# Altium project STM32_BLE_Board.PrjPcb
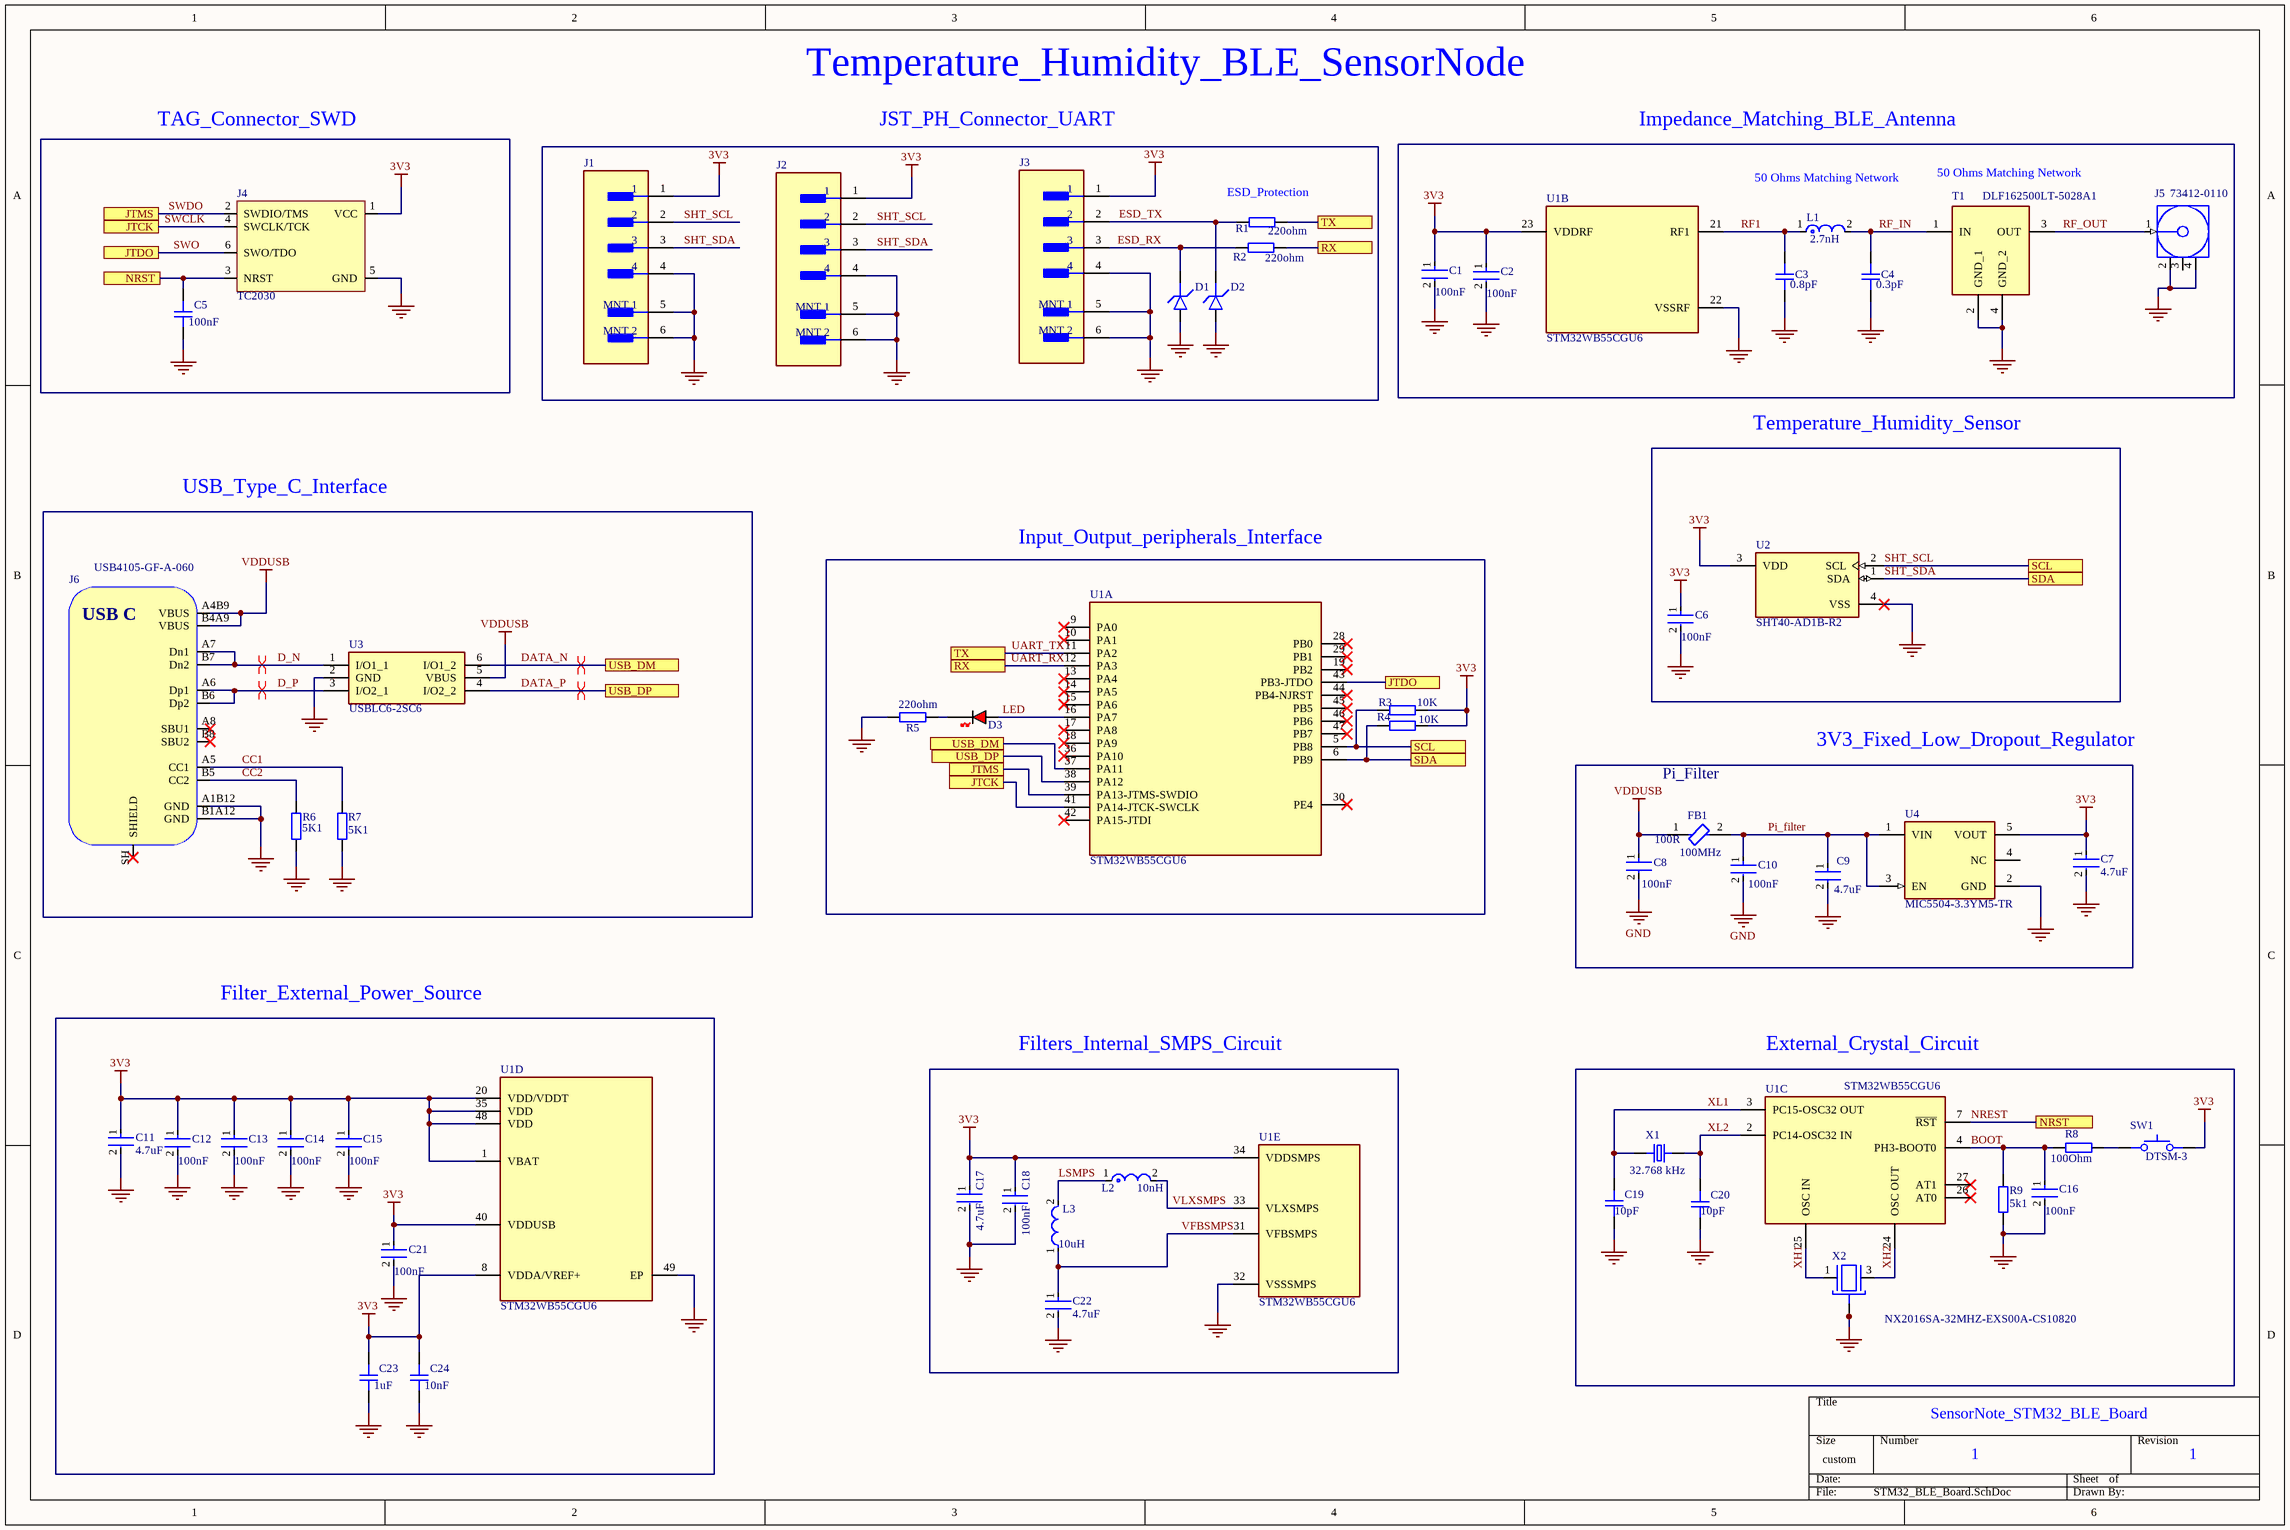
[diagram p0: STM32_BLE_Board.SchDoc]
1 sheet, 54 parts. Net scope: flat (ports and power ports of the same name join across sheets).
Board file: STM32WB55.PcbDoc

## Sheet STM32_BLE_Board.SchDoc
size 449 x 299 mm; SheetNumber: 1; SheetTotal: 1; SPICEModelCacheYUVFMELA: <root> / <DocumentId>YUVFMELA</DocumentId> / </root>

### Parts
C1  Capacitance: 100nF  [FP-C0402-BB-MFG]  (hidden comment: C0402C104K8RAC)
C2  Capacitance: 100nF  [FP-C0402-BB-MFG]  (hidden comment: C0402C104K8RAC)
C3  Rating: 0.8pF  [CAP_0402]  (hidden comment: GRM1555C2AR80BA01D)
C4  Rating: 0.3pF  [CAP_0402]  (hidden comment: GRM1555C1HR30WA01D)
C5  Rating: 100nF  [CAP_0402]  (hidden comment: C0402)
C6  Capacitance: 100nF  [FP-C0402-BB-MFG]  (hidden comment: C0402C104K8RAC)
C7  Capacitance: 4.7uF  [FP-CL10-IPC_C]  (hidden comment: CL10A475KP8NNND)
C8  Capacitance: 100nF  [FP-C0402-BB-MFG]  (hidden comment: C0402C104K8RAC)
C9  Capacitance: 4.7uF  [FP-CL10-IPC_C]  (hidden comment: CL10A475KP8NNND)
C10  Capacitance: 100nF  [FP-C0402-BB-MFG]  (hidden comment: C0402C104K8RAC)
C11  Capacitance: 4.7uF  [FP-CL10-IPC_C]  (hidden comment: CL10A475KP8NNND)
C12  Capacitance: 100nF  [FP-C0402-BB-MFG]  (hidden comment: C0402C104K8RAC)
C13  Capacitance: 100nF  [FP-C0402-BB-MFG]  (hidden comment: C0402C104K8RAC)
C14  Capacitance: 100nF  [FP-C0402-BB-MFG]  (hidden comment: C0402C104K8RAC)
C15  Capacitance: 100nF  [FP-C0402-BB-MFG]  (hidden comment: C0402C104K8RAC)
C16  Capacitance: 100nF  [FP-C0402-BB-MFG]  (hidden comment: C0402C104K8RAC)
C17  Capacitance: 4.7uF  [FP-CL10-IPC_C]  (hidden comment: CL10A475KP8NNND)
C18  Capacitance: 100nF  [FP-C0402-BB-MFG]  (hidden comment: C0402C104K8RAC)
C19  Rating: 10pF  [CAP_0402]  (hidden comment: C0402)
C20  Rating: 10pF  [CAP_0402]  (hidden comment: C0402)
C21  Capacitance: 100nF  [FP-C0402-BB-MFG]  (hidden comment: C0402C104K8RAC)
C22  Capacitance: 4.7uF  [FP-CL10-IPC_C]  (hidden comment: CL10A475KP8NNND)
C23  Rating: 1uF  [CAP_0402]  (hidden comment: C0402)
C24  Rating: 10nF  [CAP_0402]  (hidden comment: C0402)
D1  D_TVS_0402  [D_0402]  (value not drawn)
D2  D_TVS_0402  [D_0402]  (value not drawn)
D3  RED  [LED_0402_RED]  (value not drawn)
FB1  Impedance: 100R  Test Frequency: 100MHz  [FP-BLM18-0_15-t0_5-MFG]  (hidden comment: BLM18EG101TN1D)
J1  S4B-ZR-SM4A-TF(LF)(SN)  [FP-S4B-ZR-SM4A-TF_LF_SN-MFG]  (value not drawn)
J2  S4B-ZR-SM4A-TF(LF)(SN)  [FP-S4B-ZR-SM4A-TF_LF_SN-MFG]  (value not drawn)
J3  S4B-ZR-SM4A-TF(LF)(SN)  [FP-S4B-ZR-SM4A-TF_LF_SN-MFG]  (value not drawn)
J4  TC2030  [TC2030-FP]  (no BOM)
J5  73412-0110  [MOLX-73412-0110_V]
J6  USB4105-GF-A-060  [USB4105-GF-A-060]
L1  Inductance: 2.7nH  [FP-LQG15HH_02-IPC_C]  (hidden comment: LQG15HS2N7S02D)
L2  Inductance: 10nH  [FP-LQG15WH_02-MFG]  (hidden comment: LQG15WZ10NJ02D)
L3  Inductance: 10uH  [FP-LQM21FN_70-MFG]  (hidden comment: LQM21FN100M70L)
R1  220ohm  [RES_0402]
R2  220ohm  [RES_0402]
R3  10K  [RES_0402]
R4  10K  [RES_0402]
R5  220ohm  [RES_0402]
R6  Parameter 1: 5K1  [RES_0402]  (hidden comment: R0402)
R7  5K1  [RES_0402]
R8  Parameter 1: 100Ohm  [RES_0402]  (hidden comment: R0402)
R9  5k1  [RES_0402]
SW1  DTSM-3  [DTSM-3]
T1  DLF162500LT-5028A1  [DLF162500LT5028A1]
U1  STM32WB55CGU6  [FP-STM32WB55CGU6-IPC_B]  (parts A,B,C,D,E of 5)
U2  SHT40-AD1B-R2  [FP-SHT40-AD1B-R2-MFG]
U3  USBLC6-2SC6  [SOT95P280X145-6N]
U4  MIC5504-3.3YM5-TR  [FP-SOT23-5LD-PL-1-MFG]
X1  value 32.768 kHz  [XTAL_NX2012SA-32.768K-STD-MUB-1]  (hidden comment: NX2012SA-32.768K-STD-MUB-1)
X2  NX2016SA-32MHZ-EXS00A-CS10820  [OSC_NX2016SA-24MHZ-EXS00A-CS10820]

### Ports
JTCK (see STM32_BLE_Board[1A]), JTCK (see STM32_BLE_Board[3C]), JTDO (see STM32_BLE_Board[1A]), JTDO (see STM32_BLE_Board[4B]), JTMS (see STM32_BLE_Board[1A]), JTMS (see STM32_BLE_Board[3C]), NRST (see STM32_BLE_Board[1A]), NRST (see STM32_BLE_Board[6C]), RX (see STM32_BLE_Board[3B]), RX (see STM32_BLE_Board[4A]), SCL (see STM32_BLE_Board[4B]), SCL (see STM32_BLE_Board[6B]), SDA (see STM32_BLE_Board[4B]), SDA (see STM32_BLE_Board[6B]), TX (see STM32_BLE_Board[3B]), TX (see STM32_BLE_Board[4A]), USB_DM (see STM32_BLE_Board[2B]), USB_DM (see STM32_BLE_Board[3B]), USB_DP (see STM32_BLE_Board[2B]), USB_DP (see STM32_BLE_Board[3B])

### Nets
3V3: C1.1 C2.1 C6.1 C7.1 C11.1 C12.1 C13.1 C14.1 C15.1 C17.1 C18.1 C21.1 C23.2 C24.2 J1.1 J2.1 J3.1 J4.1(VCC) R3.2 R4.2 SW1.2 U1.1(VBAT) U1.8(VDDA/VREF+) U1.20(VDD/VDDT) U1.23(VDDRF) U1.34(VDDSMPS) U1.35(VDD) U1.40(VDDUSB) U1.48(VDD) U2.3(VDD) U4.5(VOUT)
GND: C1.2 C2.2 C3.1 C4.1 C5.1 C6.2 C7.2 C8.2 C9.2 C10.2 C11.2 C12.2 C13.2 C14.2 C15.2 C16.2 C17.2 C18.2 C19.1 C20.1 C21.2 C22.2 C23.1 C24.1 D1.A D2.A J1.4 J1.5(MNT_1) J1.6(MNT_2) J2.4 J2.5(MNT_1) J2.6(MNT_2) J3.4 J3.5(MNT_1) J3.6(MNT_2) J4.5(GND) J5.2(GND) J5.4(GND) J6.A1B12(GND) J6.B1A12(GND) R5.2 R6.2 R7.2 R9.1 T1.2(GND_1) T1.4(GND_2) U1.22(VSSRF) U1.32(VSSSMPS) U1.49(EP) U2.4(VSS) U3.2(GND) U4.2(GND) X2.2(GND) X2.4(GND)
VDDUSB: C8.1 FB1.1 J6.A4B9(VBUS) J6.B4A9(VBUS) U3.5(VBUS)
BOOT: C16.1 R8.2 R9.2 U1.4(PH3-BOOT0)
CC1: J6.A5(CC1) R7.1
CC2: J6.B5(CC2) R6.1
D_N: J6.A7(Dn1) J6.B7(Dn2) U3.1(I/O1_1)
D_P: J6.A6(Dp1) J6.B6(Dp2) U3.3(I/O2_1)
DATA_N: U1.37(PA11) U3.6(I/O1_2) ; port USB_DM
DATA_P: U1.38(PA12) U3.4(I/O2_2) ; port USB_DP
ESD_RX: D1.K J3.3 R2.2
ESD_TX: D2.K J3.2 R1.2
LED: D3.A U1.16(PA7)
LSMPS: L2.1 L3.2
NREST: C5.2 J4.3(NRST) U1.7(~{RST}) ; port NRST
Pi_filter: C9.1 C10.1 FB1.2 U4.1(VIN) U4.3(EN)
RF1: C3.2 L1.1 U1.21(RF1)
RF_IN: C4.2 L1.2 T1.1(IN)
RF_OUT: J5.1(SIGNAL) T1.3(OUT)
SHT_SCL: J1.2 J2.2 R3.1 U1.5(PB8) U2.2(SCL) ; port SCL
SHT_SDA: J1.3 J2.3 R4.1 U1.6(PB9) U2.1(SDA) ; port SDA
SWCLK: J4.4(SWCLK/TCK) U1.41(PA14-JTCK-SWCLK) ; port JTCK
SWDO: J4.2(SWDIO/TMS) U1.39(PA13-JTMS-SWDIO) ; port JTMS
SWO: J4.6(SWO/TDO) U1.43(PB3-JTDO) ; port JTDO
UART_RX: R2.1 U1.12(PA3) ; port RX
UART_TX: R1.1 U1.11(PA2) ; port TX
VFBSMPS: C22.1 L3.1 U1.31(VFBSMPS)
VLXSMPS: L2.2 U1.33(VLXSMPS)
XH1: U1.25(OSC_IN) X2.1
XH2: U1.24(OSC_OUT) X2.3
XL1: C19.2 U1.3(PC15-OSC32_OUT) X1.1
XL2: C20.2 U1.2(PC14-OSC32_IN) X1.2
NetD3_K: D3.K R5.1
NetR8_1: R8.1 SW1.1

Not connected (* = marked no-connect by the designer): J5 3(GND); J6 A8(SBU1)* B8(SBU2)* SH(SHIELD)*; U1 9(PA0)* 10(PA1)* 13(PA4)* 14(PA5)* 15(PA6)* 17(PA8)* 18(PA9)* 19(PB2)* 26(AT0)* 27(AT1)* 28(PB0)* 29(PB1)* 30(PE4)* 36(PA10)* 42(PA15-JTDI)* 44(PB4-NJRST)* 45(PB5)* 46(PB6)* 47(PB7)*; U4 4(NC)

### Layout directives
differential pair: D_N, D_P, DATA_N, DATA_P

### Notes on the sheet
- TAG_Connector_SWD
- Temperature_Humidity_BLE_SensorNode
- JST_PH_Connector_UART
- Impedance_Matching_BLE_Antenna
- (near R1) ESD_Protection
- 50 Ohms Matching Network
- (near T1) 50 Ohms Matching Network
- Temperature_Humidity_Sensor
- USB_Type_C_Interface
- Input_Output_peripherals_Interface
- (near FB1) Pi_Filter
- 3V3_Fixed_Low_Dropout_Regulator
- Filter_External_Power_Source
- Filters_Internal_SMPS_Circuit
- External_Crystal_Circuit
- SensorNote_STM32_BLE_Board
- 1
- (in symbol USB4105-GF-A-060) USB C

### Library data of the parts
C1 C2 C6 C8 C10 C12-C16 C18 C21 = CMP-03020-004693-2: C0402 0.10 μF X7R 10.00% 10 V; Manufacturer: Kemet; Voltage Rating: 10 V; Value: 100nF; Tolerance: 0.1; Material: Ceramic; Temperature Coefficient: 15%; Package: C0402-BB; RoHS: TRUE; ComponentLink2Description: Datasheet; Temperature Range Low: -55°C; Octopart: https://octopart.com/c0402c104k8rac-kemet-2610564; Automotive: No; Device Class L3: Ceramic Capacitors; Temperature Characteristic: X7R; Device Class L1: Passive Components; Ipc Land Pattern Name: CAPC10050X50; ComponentLink2URL: https://content.kemet.com/datasheets/KEM_C1002_X7R_SMD.pdf; Manufacturer Part Number: C0402C104K8RAC; Mouser Description: Cap Ceramic 0.1uF 10V X7R 10% Pad SMD 0402 125C Bulk; Category: Cap; Temperature Range High: +125°C; Height: 0.55mm; Lead Free: Yes; Device Class L2: Capacitors; Temperature: -55°C to +125°C
C3 = CAP_0402: 0.8 pF ±0.1pF 100V Ceramic Capacitor C0G, NP0 0402 (1005 Metric; Manufacturer: Murata Electronics; Manufacturer Part Number: GRM1555C2AR80BA01D; Distributor Link: https://www.murata.com/en-global/products/productdetail?partno=GRM1555C1HR30WA01%23; LCSC: *; Dielectric: *
C4 = CAP_0402: Multilayer Ceramic Capacitors MLCC - SMD/SMT 0.3 pF 50 VDC 0.05 pF 0402 C0G (NP0); Manufacturer: Murata Electronics; Manufacturer Part Number: GRM1555C1HR30WA01D; Distributor Link: https://www.murata.com/en-global/products/productdetail?partno=GRM1555C1HR30WA01%23; LCSC: *; Dielectric: *
C5 C19 C20 C23 C24 = CAP_0402: Capacitor SMD 0402; Manufacturer: *; Manufacturer Part Number: *; Distributor Link: *; LCSC: *; Dielectric: *
C7 C9 C11 C17 C22 = CMP-13271-003065-1: Cap Ceramic 4.7uF 10V X5R ±10% Pad SMD 0603 +85°C T/R; Height: 0.8mm; Tolerance: 10%; Voltage Rating: 10V; Voltage Rating (DC): 10V; Packaging: Tape and Reel; Dielectric: X5R; Width: 0.031inch; Max Operating Temperature: 85°C; Radiation Hardening: No; Package Quantity: 10000; Case/Package: 0603; Mount: Surface Mount; Min Operating Temperature: -55°C; Thickness: 0.035inch; Length: 1.6mm; Depth: 0.8mm
D1 D2 = D_TVS_0402: Diode TVS / ESD 0402
D3 = LED_0402_RED: LED 0402 RED SMD
FB1 = CMP-0686-00530-3: Chip Ferrite Bead, 0603, 100Ω @ 100MHz, 25%, 0.045Ω, 2A; DC Resistance (DCR): 45mR; Number of Circuits: 1; Max Current Rating: 2A; Depth: 0.8mm; Case Code (Imperial): 0603; Tolerance: 25%; Packaging: Tape and Reel; Core Material: Ferrite; Material: Ferrite; Termination: SMD/SMT; Case Code (Metric): 1608; Package Quantity: 1; Length: 1.6mm; Contact Plating: Tin; Lead Free: Lead Free; Max Operating Temperature: 125°C; Height: 0.8mm; Current Rating: 2A; REACH SVHC: No SVHC; Max DC Current: 2A; Min Operating Temperature: -55°C; Case/Package: 0603; Number of Pins: 2; Width: 0.8mm; Number of Lines: 1
J1-J3 = CMP-17439-000081-1: CONN HEADER SMD R/A 4POS 1.5MM; Gender: Male; Max Current Rating: 1A; Max Voltage Rating (AC): 50V; Number of Contacts: 4; Contact Resistance: 30mR; Pitch: 1.5mm; Depth: 6.5mm; Current Rating: 1A; Packaging: Tape and Reel; Contact Shape: Circular; Voltage Rating: 50V; Insulation Material: Nylon; Color: Natural; Contact Plating: Copper; Width: 3.5mm; Orientation: Right Angle; Length: 9mm; Number of Rows: 1; Lead Free: Lead Free; Insulation Color: Natural; Flammability Rating: UL94 V-0; Housing Color: Beige; Min Operating Temperature: -25°C; Housing Material: Polyamide; Contact Type: Male Pin; Max Operating Temperature: 85°C; Number of Positions: 4; Connector Type: Header; Mount: Surface Mount; Termination: Solder; Max Voltage Rating (DC): 50V; Contact Finish - Mating: TIN; Fastening Type: Detent; Height: 7.2mm; Series: ZH; Contact Material: Brass
J4 = TC2030: Tag-Connect No-Solder SWD Debug Connector DO NOT PLACE; Manufacturer: Tag-Connect; Manufacturer Part Number: TC2030
J5 = CMP-1676-00003-1: MCRF, PCB Vertical Jack Receptacle, 50 Ohm, 4-Pin SMD, RoHS, Tape and Reel; Voltage Rating (AC): 60 V; Mating Cycles: 30; Impedance: 50 Ohm; Frequency: 6 Hz; Gender: Female; RoHSCompliant: true; Length: 3 mm; DatasheetVersion: 04/2016; ComponentLink3URL: http://www.molex.com/pdm_docs/sd/734120110_sd.pdf; Max Operating Temperature: 90 degC; Contact Material: Bronze; Mount: Surface Mount; ComponentLink2Description: Datasheet; Packaging: Tape and Reel; Radiation Hardening: No; Voltage Rating: 60 V; Mounting Technology: Surface Mount; ComponentLink1Description: Manufacturer URL; ComponentLink1URL: http://www.molex.com/; Width: 3 mm; ComponentLink3Description: Package Specification; Package Quantity: 5000; PackageReference: 73412-0110; Min Operating Temperature: -40 degC; Height: 1.25 mm; REACH SVHC: Unknown; ComponentLink2URL: http://www.molex.com/webdocs/datasheets/pdf/en-us/0734120110_RF_COAX_CONNECTORS.pdf; Contact Plating: Gold; PackageDescription: 4-Leads SMD, Body 2.6 x 2.6 mm; PackageVersion: Rev. C14, 07/2015
J6 = USB4105-GF-A-060: USB Connector Type C SMT 12 Pin; Manufacturer: GCT; Manufacturer Part Number: USB4105-GF-A-060; Distributor Link: https://eu.mouser.com/ProductDetail/GCT/USB4105-GF-A-060?qs=QNEnbhJQKvY2mocwNJzgfA%3D%3D
L1 = CMP-2000-06580-2: Multilayer type RF Inductor 2.7nH ±0.3nH 0.12Ω 800mA 0402; Max DC Current: 300mA; Q Factor: 8; Core Material: Air; Test Frequency: 100MHz; Shielding: Unshielded; Self Resonant Frequency: 6GHz; DC Resistance (DCR): 150mR; Packaging: Tape and Reel; Depth: 0.55mm; DC Current: 300mA; Length: 1mm; Current Rating: 300mA; Lead Free: Lead Free; Max Operating Temperature: 125°C; Mount: Surface Mount; Height - Seated (Max): 0.022inch; Case Code (Imperial): 0402; Height: 0.5mm; Termination: SMD/SMT; Package Quantity: 10000; Radiation Hardening: No; Width: 0.5mm; Case Code (Metric): 1005; Min Operating Temperature: -55°C; Military Standard: Not; Case/Package: 0402
L2 = CMP-06042-005237-1: Multilayer type Inductor for Automotive 10nH ±5% 0.19Ω 500mA 0402; Core Material: Air; Test Frequency: 100MHz; DC Resistance (DCR): 190mR; Shielding: Unshielded; Self Resonant Frequency: 3.3GHz; Min Operating Temperature: -55°C; Tolerance: 5%; Max Operating Temperature: 125°C; Packaging: Cut Tape; Current Rating: 500mA; Case Code (Metric): 1005; Mount: Surface Mount; Case/Package: 0402; Ratings: AEC-Q200; Case Code (Imperial): 0402
L3 = CMP-2000-06587-2: FIXED IND 10UH 100MA 780MOHM SMD; Shielding: Shielded; Core Material: Ferrite; Self Resonant Frequency: 15MHz; Tolerance: 20%; DC Resistance (DCR): 780mR; Test Frequency: 1MHz; Height: 1.45mm; Package Quantity: 3000; Width: 0.049inch; Saturation Current: 100mA; Termination: SMD/SMT; Case Code (Metric): 2012; Case/Package: 0805; RoHS Compliant: Yes; Series: LQM21F_70; Max Operating Temperature: 125°C; Lead Free: Lead Free; DC Current: 100mA; Length: 2.2mm; Radiation Hardening: No; Max DC Current: 100mA; Case Code (Imperial): 0805; Packaging: Tape and Reel; Height - Seated (Max): 0.057inch; Rated Current-Max: 100mA; Military Standard: Not; Mount: Surface Mount; Min Operating Temperature: -55°C; Depth: 1.45mm; Current Rating: 100mA
R1-R9 = RES_0402: Resistor SMD 0402; Manufacturer: *; Manufacturer Part Number: *; Distributor Link: *; LCSC: *
SW1 = DTSM-3: Tactile Switch SMD SPST; Manufacturer: Diptronics; Manufacturer Part Number: DTSM-3
T1 = DLF162500LT-5028A1: Filter; Manufacturer_Name: TDK; Datasheet Link: https://product.tdk.com/system/files/dam/doc/product/rf/rf/filter/catalog/rf_lpf_dlf162500lt-5028a1_en.pdf; Height: 0.4mm; Manufacturer_Part_Number: DLF162500LT-5028A1; Mouser Part Number: 810-DLF16250LT5028A1; Mouser Price/Stock: https://www.mouser.co.uk/ProductDetail/TDK/DLF162500LT-5028A1?qs=U%2FZX79kHR%2FlwIbAISCs3qA%3D%3D; Arrow Part Number: DLF162500LT-5028A1; Arrow Price/Stock: https://www.arrow.com/en/products/dlf162500lt-5028a1/tdk?region=europe
U1 = CMP-12105-000013-1: ULTRA-LOW-POWER DUAL CORE ARM CO; Manufacturer: STMicroelectronics; Number Of Cores: 1; Number Of I2C Channels: 2; Interface: I2C,SPI,UART,USART,2-Wire,USB,IrDA,Other; Core Architecture: ARM Cortex-M4; Data Bus Width: 32bits; Memory Size: 1MBytes; Number Of Pwm Channels: 14; Max Supply Voltage: 3.6V; Standoff Height: 0mm; Number Of Timers/Counters: 6; Frequency: 64MHz; Max Junction Temp: +105°C; Number Of I/Os: 30; Min Supply Voltage: 1.71V; Number Of Adc Channels: 13; Ram Size: 256KBytes; Memory Type: FLASH; Octopart: https://octopart.com/stm32wb55cgu6-stmicroelectronics-98750847; Temperature Range High: +105°C; RoHS: TRUE; Number Of Spi Channels: 1; Category: IC; Device Class L1: Integrated Circuits (ICs); Lead Free: Yes; Height: 0.65mm; Number Of A/D Converters: 1; Package: UFQFPN48; Number Of Usb Channels: 1; Number Of Uart Channels: 2; Temperature Range Low: -40°C; Ambient Temperature Range Low: -40°C; Device Class L3: Microcontrollers; Manufacturer Part Number: STM32WB55CGU6; Temperature: -40°C to +105°C; ComponentLink2URL: https://www.st.com/resource/en/datasheet/stm32wb55cg.pdf; Device Class L2: Embedded Processors and Controllers; Digikey Description: ULTRA-LOW-POWER DUAL CORE ARM CO; ComponentLink2Description: Datasheet; Ambient Temperature Range High: +85°C; Automotive: No
U2 = CMP-144040-000008-1: SENSOR HUMIDITY 100 RH SMD
U3 = USBLC6-2SC6: Integrated Circuit; Manufacturer_Name: STMicroelectronics; Datasheet Link: http://www.st.com/st-web-ui/static/active/en/resource/technical/document/datasheet/CD00050750.pdf; Height: 1.45mm; Manufacturer_Part_Number: USBLC6-2SC6; Mouser Part Number: 511-USBLC6-2SC6; Mouser Price/Stock: https://www.mouser.co.uk/ProductDetail/STMicroelectronics/USBLC6-2SC6?qs=po45yt2pPpu%2FhNIlwQdTlg%3D%3D; Arrow Part Number: USBLC6-2SC6; Arrow Price/Stock: https://www.arrow.com/en/products/usblc6-2sc6/stmicroelectronics?utm_currency=USD&region=europe
U4 = CMP-2000-07604-2: IC REG LINEAR 3.3V 300MA SOT23-5; Quiescent Current: 38uA; Operating Supply Current: 42uA; Max Input Voltage: 5.5V; Min Input Voltage: 2.5V; Output Type: Fixed; Power Supply Rejection Ratio (PSRR): 60dB; Dropout Voltage: 380mV; Accuracy: 3%; Number of Outputs: 1; Nominal Output Voltage: 3.3V; Max Output Current: 300mA; Length: 2.9mm; Mount: Surface Mount; Width: 1.6mm; Packaging: Tape and Reel; Output Current: 300mA; Min Operating Temperature: -40°C; Max Operating Temperature: 125°C; Height: 1.1mm; Case/Package: SOT-23-5; REACH SVHC: No SVHC; Number of Pins: 5; Output Voltage: 3.3V
X1 = NX2012SA-32.768K-STD-MUB-1: 32.768 kHz Â±20ppm Crystal 12.5pF 80 kOhms 2-SMD, No Lead; MF: NDK America,; Package: SMD-2 NDK; Price: None; Check_prices: https://www.snapeda.com/parts/NX2012SA-32.768K-STD-MUB-1/NDK+America%252C+Inc./view-part/?ref=eda; SnapEDA_Link: https://www.snapeda.com/parts/NX2012SA-32.768K-STD-MUB-1/NDK+America%252C+Inc./view-part/?ref=snap; MP: NX2012SA-32.768K-STD-MUB-1; Availability: In Stock; Purchase-URL: https://pricing.snapeda.com/search/part/NX2012SA-32.768K-STD-MUB-1/?ref=eda
X2 = NX2016SA-24MHZ-EXS00A-CS10820: 24 MHz - Crystal 6pF 80 Ohms 4-SMD, No Lead; MF: NDK America, Inc.; Check_prices: https://www.snapeda.com/parts/NX2016SA-24MHZ-EXS00A-CS10820/NDK+America%252C+Inc./view-part/?ref=eda; Value: *; MP: NX2016SA-24MHZ-EXS00A-CS10820; Purchase-URL: https://pricing.snapeda.com/search/part/NX2016SA-24MHZ-EXS00A-CS10820/?ref=eda; SnapEDA_Link: https://www.snapeda.com/parts/NX2016SA-24MHZ-EXS00A-CS10820/NDK+America%252C+Inc./view-part/?ref=snap; Package: SMD-4 NDK America,; Digi-Key_Part_Number: 644-1365-2-ND